# EAGLE design TLC4LEDShield (EAGLE 6.2)
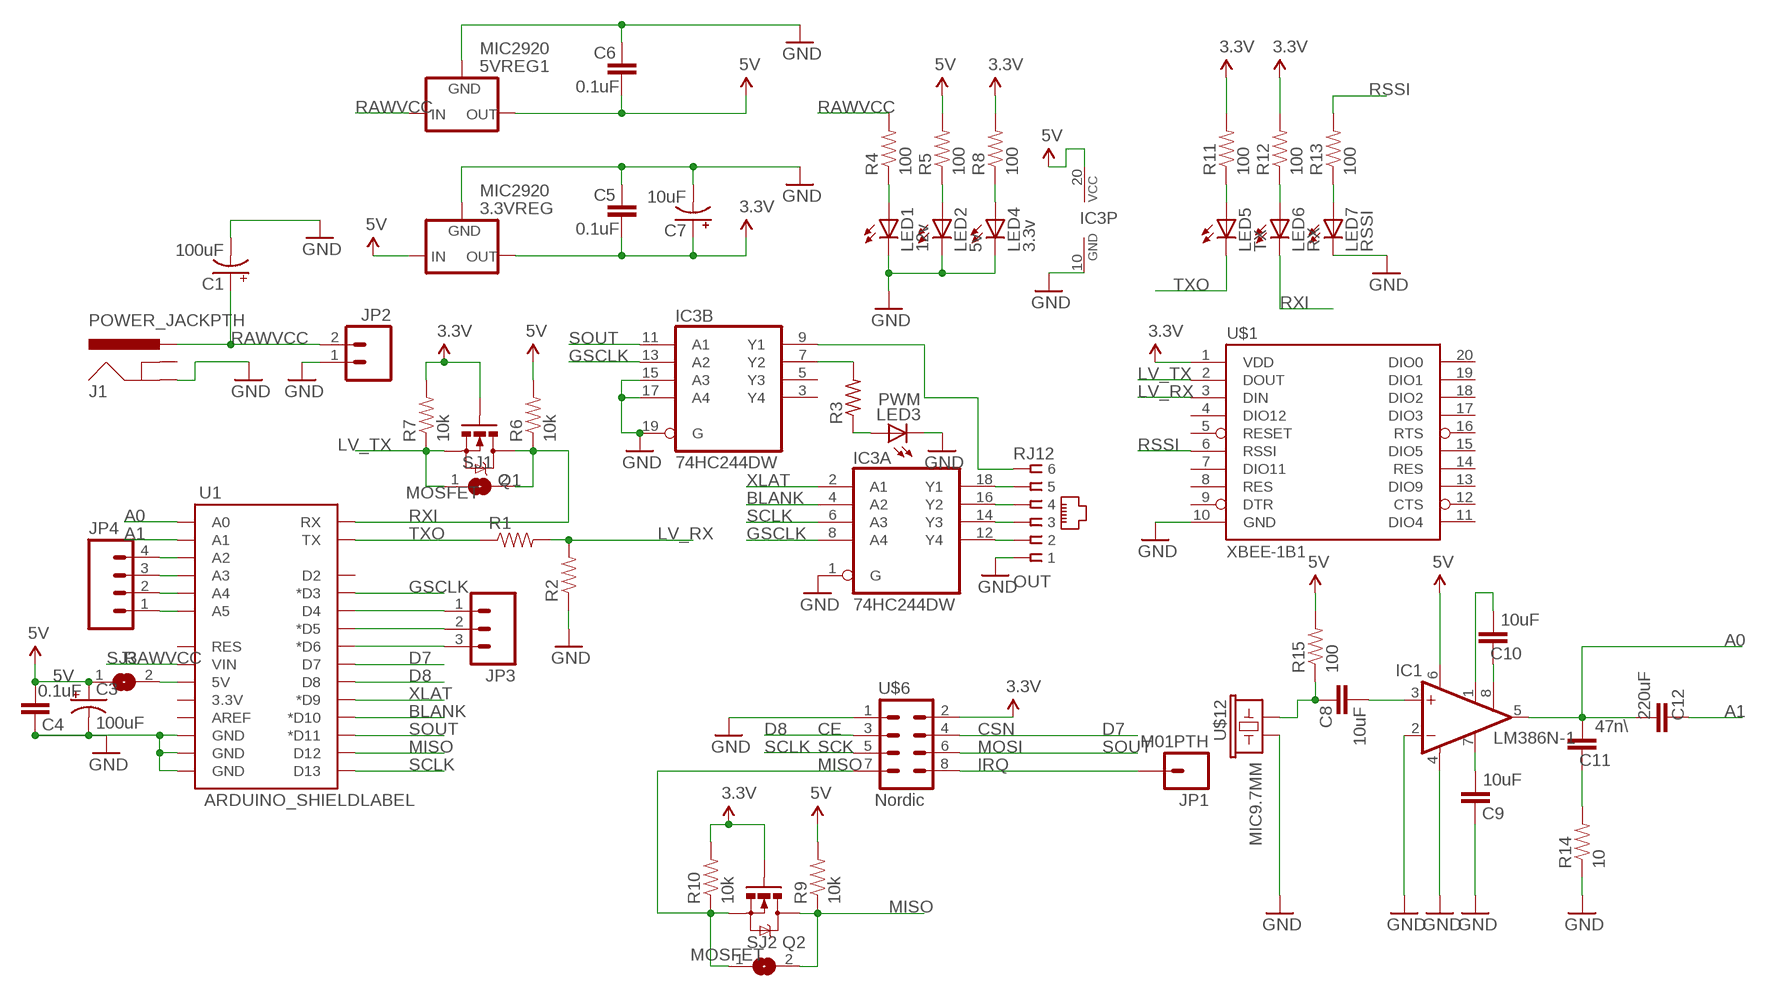
[diagram p0: schematic, sheet 1]

## Parts
3.3VREG  MIC2920  V_REG_MIC2920  [SOT223]
5VREG1  MIC2920  V_REG_MIC2920  [SOT223]
C1  100uF  CAP_POLD  [PANASONIC_D]
C3  100uF  CAP_POLD  [PANASONIC_D]
C4  0.1uF  CAP0805  [0805]
C5  0.1uF  CAP0805  [0805]
C6  0.1uF  CAP0805  [0805]
C7  10uF  CAP_POL1206  [EIA3216]
C8  10uF  CAP0805  [0805]
C9  10uF  CAP0805  [0805]
C10  10uF  CAP0805  [0805]
C11  47n\  CAP0805  [0805]
C12  220uF  CAP0805  [0805]
IC1  LM386N-1  [DIL08]
IC3  74HC244DW  [SO20W]
J1  POWER_JACKPTH  [POWER_JACK_PTH]
JP1  M01PTH  [1X01]
JP2  M025MM  [SCREWTERMINAL-5MM-2]
JP3  M03PTH  [1X03]
JP4  M04PTH  [1X04]
LED1  12v  LEDCHIPLED_0805  [CHIPLED_0805]
LED2  5v  LEDCHIPLED_0805  [CHIPLED_0805]
LED3  PWM  LEDCHIPLED_0805  [CHIPLED_0805]
LED4  3.3v  LEDCHIPLED_0805  [CHIPLED_0805]
LED5  TX  LEDCHIPLED_0805  [CHIPLED_0805]
LED6  RX  LEDCHIPLED_0805  [CHIPLED_0805]
LED7  RSSI  LEDCHIPLED_0805  [CHIPLED_0805]
OUT  RJ12  RJ11-6L-B  [RJ11-NO_SHIELD]
Q1  MOSFET  MOSFET-NCHANNELSMD  [SOT23-3]
Q2  MOSFET  MOSFET-NCHANNELSMD  [SOT23-3]
R1  RESISTOR0805-RES  [0805]
R2  RESISTOR0805-RES  [0805]
R3  R-US_R0805  [R0805]
R4  100  RESISTOR0805-RES  [0805]
R5  100  RESISTOR0805-RES  [0805]
R6  10k  RESISTOR0805-RES  [0805]
R7  10k  RESISTOR0805-RES  [0805]
R8  100  RESISTOR0805-RES  [0805]
R9  10k  RESISTOR0805-RES  [0805]
R10  10k  RESISTOR0805-RES  [0805]
R11  100  RESISTOR0805-RES  [0805]
R12  100  RESISTOR0805-RES  [0805]
R13  100  RESISTOR0805-RES  [0805]
R14  10  RESISTOR0805-RES  [0805]
R15  100  RESISTOR0805-RES  [0805]
SJ1  SJ  [SJ]
SJ2  SJ  [SJ]
SJ3  SJ  [SJ]
U1  ARDUINO_SHIELDLABEL  [DUEMILANOVE_SHIELD]
U$1  XBEE-1B1  [XBEE-1]
U$6  Nordic  M04X2  [2X4]
U$12  MIC9.7MM  [MIC-9.7MM]

## Nets
3.3V [medium]: 3.3VREG.3(OUT) C5.1 C7.A(+) Q1.1(G) Q2.1(G) R7.2 R8.2 R10.2 R11.2 R12.2 U$1.1(VDD) U$6.2
5V [medium]: 3.3VREG.1(IN) 5VREG1.3(OUT) C3.+ C4.1 C6.1 IC1.6(VS) IC3.20(P:VCC) R5.2 R6.2 R9.2 R15.2 SJ3.1
A0: C11.1 C12.1 IC1.5(OUT) U1.A0
A1: C12.2 U1.A1
BLANK: IC3.4(A:A2) U1.D10(*D10)
D7: U1.D7 U$6.4
D8: U1.D8 U$6.3
GND [PWR]: 3.3VREG.2(GND) 5VREG1.2(GND) C1.- C3.- C4.2 C5.2 C6.2 C7.C(-) C9.2 IC1.2(-IN) IC1.4(GND) IC3.1(A:G) IC3.10(P:GND) IC3.15(B:A3) IC3.17(B:A4) IC3.19(B:G) J1.GND JP2.1 LED1.C LED2.C LED3.C LED4.C LED7.C OUT.1 R2.1 R14.1 U1.GND@0(GND) U1.GND@1(GND) U1.GND@2(GND) U$1.10(GND) U$6.1 U$12.2
GSCLK: IC3.8(A:A4) IC3.13(B:A2) U1.D3(*D3)
LV_RX: R1.2 R2.2 U$1.3(DIN)
LV_TX: Q1.2(S) R7.1 SJ1.1 U$1.2(DOUT)
MISO: Q2.3(D) R9.1 SJ2.2 U1.D12
N$1: IC3.12(A:Y4) OUT.2
N$2: IC3.14(A:Y3) OUT.3
N$3: IC3.16(A:Y2) OUT.4
N$4: IC3.18(A:Y1) OUT.5
N$5: LED2.A R5.1
N$6: LED1.A R4.1
N$7: LED5.A R11.1
N$8: LED6.A R12.1
N$9: Q2.2(S) R10.1 SJ2.1 U$6.7
N$10: LED7.A R13.1
N$11: SJ3.2 U1.5V
N$12: JP1.1 U$6.8
N$13: LED4.A R8.1
N$14: JP3.1 U1.D4
N$15: JP3.2 U1.D5(*D5)
N$16: JP3.3 U1.D6(*D6)
N$17: JP4.1 U1.A5
N$18: IC3.9(B:Y1) OUT.6
N$19: JP4.2 U1.A4
N$20: IC3.7(B:Y2) R3.2
N$21: LED3.A R3.1
N$22: JP4.3 U1.A3
N$23: JP4.4 U1.A2
N$26: C8.1 IC1.3(+IN)
N$27: C9.1 IC1.7(BYPASS)
N$28: C10.2 IC1.8(GAIN)
N$29: C10.1 IC1.1(GAIN)
N$32: C11.2 R14.2
N$33: C8.2 R15.1 U$12.1
RAWVCC [PWR]: 5VREG1.1(IN) C1.+ J1.PWR JP2.2 R4.2 U1.VIN
RSSI: R13.2 U$1.6(RSSI)
RXI: LED6.C Q1.3(D) R6.1 SJ1.2 U1.RX
SCLK: IC3.6(A:A3) U1.D13 U$6.5
SOUT: IC3.11(B:A1) U1.D11(*D11) U$6.6
TXO: LED5.C R1.1 U1.TX
XLAT: IC3.2(A:A1) U1.D9(*D9)
Unconnected: IC3.3(B:Y4) IC3.5(B:Y3) J1.GNDBREAK U1.3.3V U1.AREF U1.D2 U1.RES U$1.4(DIO12) U$1.5(RESET) U$1.7(DIO11) U$1.8(RES) U$1.9(DTR) U$1.11(DIO4) U$1.12(CTS) U$1.13(DIO9) U$1.14(RES) U$1.15(DIO5) U$1.16(RTS) U$1.17(DIO3) U$1.18(DIO2) U$1.19(DIO1) U$1.20(DIO0)

## Notes on the sheet
- CE | CSN
- SCK | MOSI
- MISO | IRQ

## Library data of the parts
3.3VREG 5VREG1 = SparkFun:V_REG_MIC2920: MIC2920A (http://www.micrel.com/_PDF/mic2920.pdf) - 400mA output LDO Regulator
C1 C3 C7 = SparkFun:CAP_POL: Capacitor Polarized These are standard SMD and PTH capacitors. Normally 10uF, 47uF, and 100uF in electrolytic and tantalum varieties. Always verify the external diameter of the through hole cap, it varies with capacity, voltage, and manufacturer. The EIA devices should be standard.
C4-C6 C8-C12 = SparkFun:CAP: Capacitor Standard 0603 ceramic capacitor, and 0.1" leaded capacitor.
IC1 = linear:LM386?-*: Low Voltage Audio Power Amplifier Source: http://cache.national.com/ds/LM/LM386.pdf
IC3 = 74xx-eu:74*244: Octal BUFFER and LINE DRIVER, 3-state
J1 = SparkFun:POWER_JACK: Power Jack This is the standard 5.5mm barrel jack for power. The PTH is the most common, proven, reliable, footprint. All others are experimental. The Slot footprint only works if the mill layer is transmitted to the PCB fab house so be warned. Spark Fun Electronics SKU : PRT-00119. Mating wall wart : TOL-00298 (and others)
JP1 = SparkFun:M01: Header 1 Standard 1-pin 0.1" header. Use with straight break away headers (SKU : PRT-00116), right angle break away headers (PRT-00553), swiss pins (PRT-00743), machine pins (PRT-00117), and female headers (PRT-00115).
JP2 = SparkFun:M02: Header 2 Standard 2-pin 0.1" header. Use with straight break away headers (SKU : PRT-00116), right angle break away headers (PRT-00553), swiss pins (PRT-00743), machine pins (PRT-00117), and female headers (PRT-00115). Molex polarized connector foot print use with SKU : PRT-08233 with associated crimp pins and housings.
JP3 = SparkFun:M03: Header 3 Standard 3-pin 0.1" header. Use with straight break away headers (SKU : PRT-00116), right angle break away headers (PRT-00553), swiss pins (PRT-00743), machine pins (PRT-00117), and female headers (PRT-00115). Molex polarized connector foot print use with SKU : PRT-08232 with associated crimp pins and housings.
JP4 = SparkFun:M04: Header 4 Standard 4-pin 0.1" header. Use with straight break away headers (SKU : PRT-00116), right angle break away headers (PRT-00553), swiss pins (PRT-00743), machine pins (PRT-00117), and female headers (PRT-00115). Molex polarized connector foot print use with SKU : PRT-08231 with associated crimp pins and housings. 1MM SMD Version SKU: PRT-10208
LED1-LED7 = led:LED: LED OSRAM: - CHIPLED LG R971, LG N971, LY N971, LG Q971, LY Q971, LO R971, LY R971 LH N974, LH R974 LS Q976, LO Q976, LY Q976 LO Q996 - Hyper CHIPLED LW Q18S LB Q993, LB Q99A, LB R99A - SideLED LS A670, LO A670, LY A670, LG A670, LP A670 LB A673, LV A673, LT A673, LW A673 LH A674 LY A675 LS A676, LA A676, LO A676, LY A676, LW A676 LS A679, LY A679, LG A679 - Hyper Micro SIDELED® LS Y876, LA Y876, LO Y876, LY Y876 LT Y87S - SmartLED LW L88C, LW L88S LB L89C, LB L89S, LG L890 LS L89K, LO L89K, LY L89K LS L896, LA L896, LO L896, LY L896 - TOPLED LS T670, LO T670, LY T670, LG T670, LP T670 LSG T670, LSP T670, LSY T670, LOP T670, LYG T670 LG T671, LOG T671, LSG T671 LB T673, LV T673, LT T673, LW T673 LH T674 LS T676, LA T676, LO T676, LY T676, LB T676, LH T676, LSB T676, LW T676 LB T67C, LV T67C, LT T67C, LS T67K, LO T67K, LY T67K, LW E67C LS E67B, LA E67B, LO E67B, LY E67B, LB E67C, LV E67C, LT E67C LW T67C LS T679, LY T679, LG T679 LS T770, LO T770, LY T770, LG T770, LP T770 LB T773, LV T773, LT T773, LW T773 LH T774 LS E675, LA E675, LY E675, LS T675 LS T776, LA T776, LO T776, LY T776, LB T776 LHGB T686 LT T68C, LB T68C - Hyper Mini TOPLED® LB M676 - Mini TOPLED Santana® LG M470 LS M47K, LO M47K, LY M47K Source: http://www.osram.convergy.de LUXEON: - LUMILED® LXK2-PW12-R00, LXK2-PW12-S00, LXK2-PW14-U00, LXK2-PW14-V00 LXK2-PM12-R00, LXK2-PM12-S00, LXK2-PM14-U00 LXK2-PE12-Q00, LXK2-PE12-R00, LXK2-PE12-S00, LXK2-PE14-T00, LXK2-PE14-U00 LXK2-PB12-K00, LXK2-PB12-L00, LXK2-PB12-M00, LXK2-PB14-N00, LXK2-PB14-P00, LXK2-PB14-Q00 LXK2-PR12-L00, LXK2-PR12-M00, LXK2-PR14-Q00, LXK2-PR14-R00 LXK2-PD12-Q00, LXK2-PD12-R00, LXK2-PD12-S00 LXK2-PH12-R00, LXK2-PH12-S00 LXK2-PL12-P00, LXK2-PL12-Q00, LXK2-PL12-R00 Source: www.luxeon.com KINGBRIGHT: KA-3528ASYC Source: www.kingbright.com
OUT = con-tycoelectronics:RJ11: CORCOM Modular RJ Jacks No Shield Source: www.tycoelectronics.com .. ENG_DS_1654001_1099_RJ_L_0507.pdf; MF: TYCO ELECTRONICS; MPN: RJ11-6L-B; OC_FARNELL: unknown; OC_NEWARK: 52K3613
Q1 Q2 = SparkFun:MOSFET-NCHANNEL
R1 R2 R4-R15 = SparkFun:RESISTOR: Resistor Basic schematic elements and footprints for 0603, 1206, and PTH resistors.
R3 = rcl:R-US_: RESISTOR, American symbol
SJ1-SJ3 = jumper:SJ: SMD solder JUMPER
U1 = SparkFun:ARDUINO_SHIELD
U$1 = SparkFun:XBEE-1
U$6 = SparkFun:M04X2
U$12 = SparkFun:MIC: Microphone Omni-directional electret microphone. 9.7mm standard diameter.

## Net classes
0 SIGNAL: width 0.254 mm
1 PWR: width 0.508 mm
2 medium: width 0.305 mm

## Board
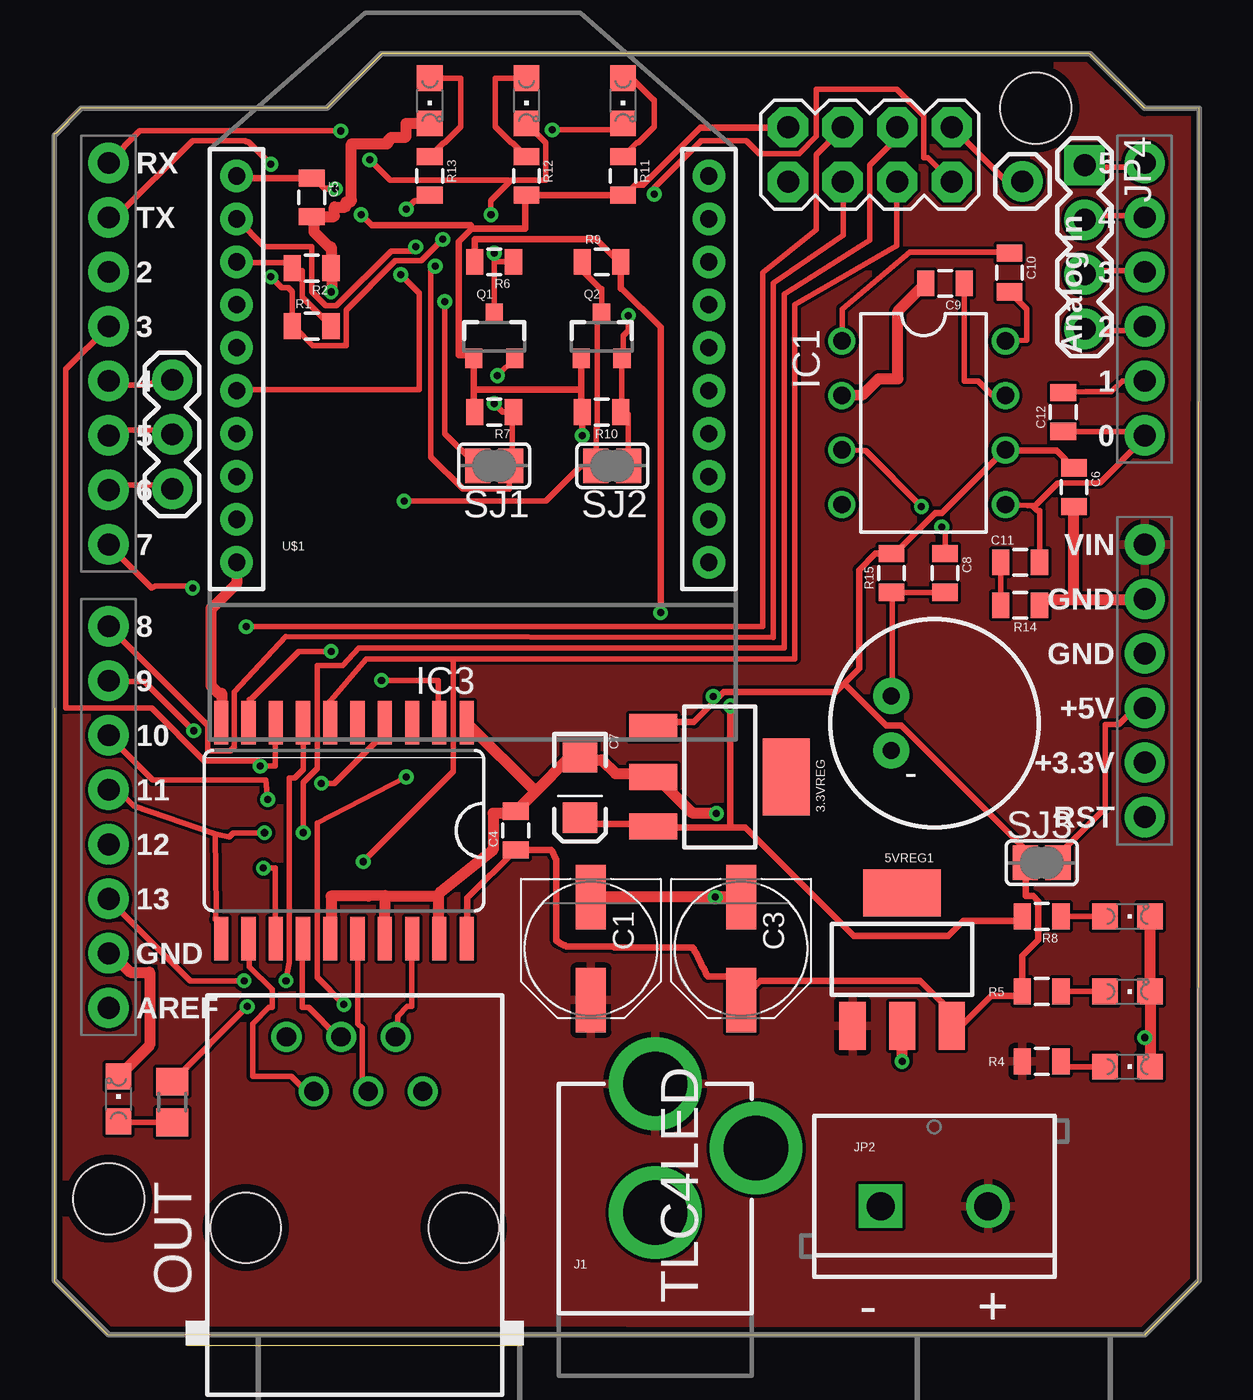
[diagram p1: board, top side]
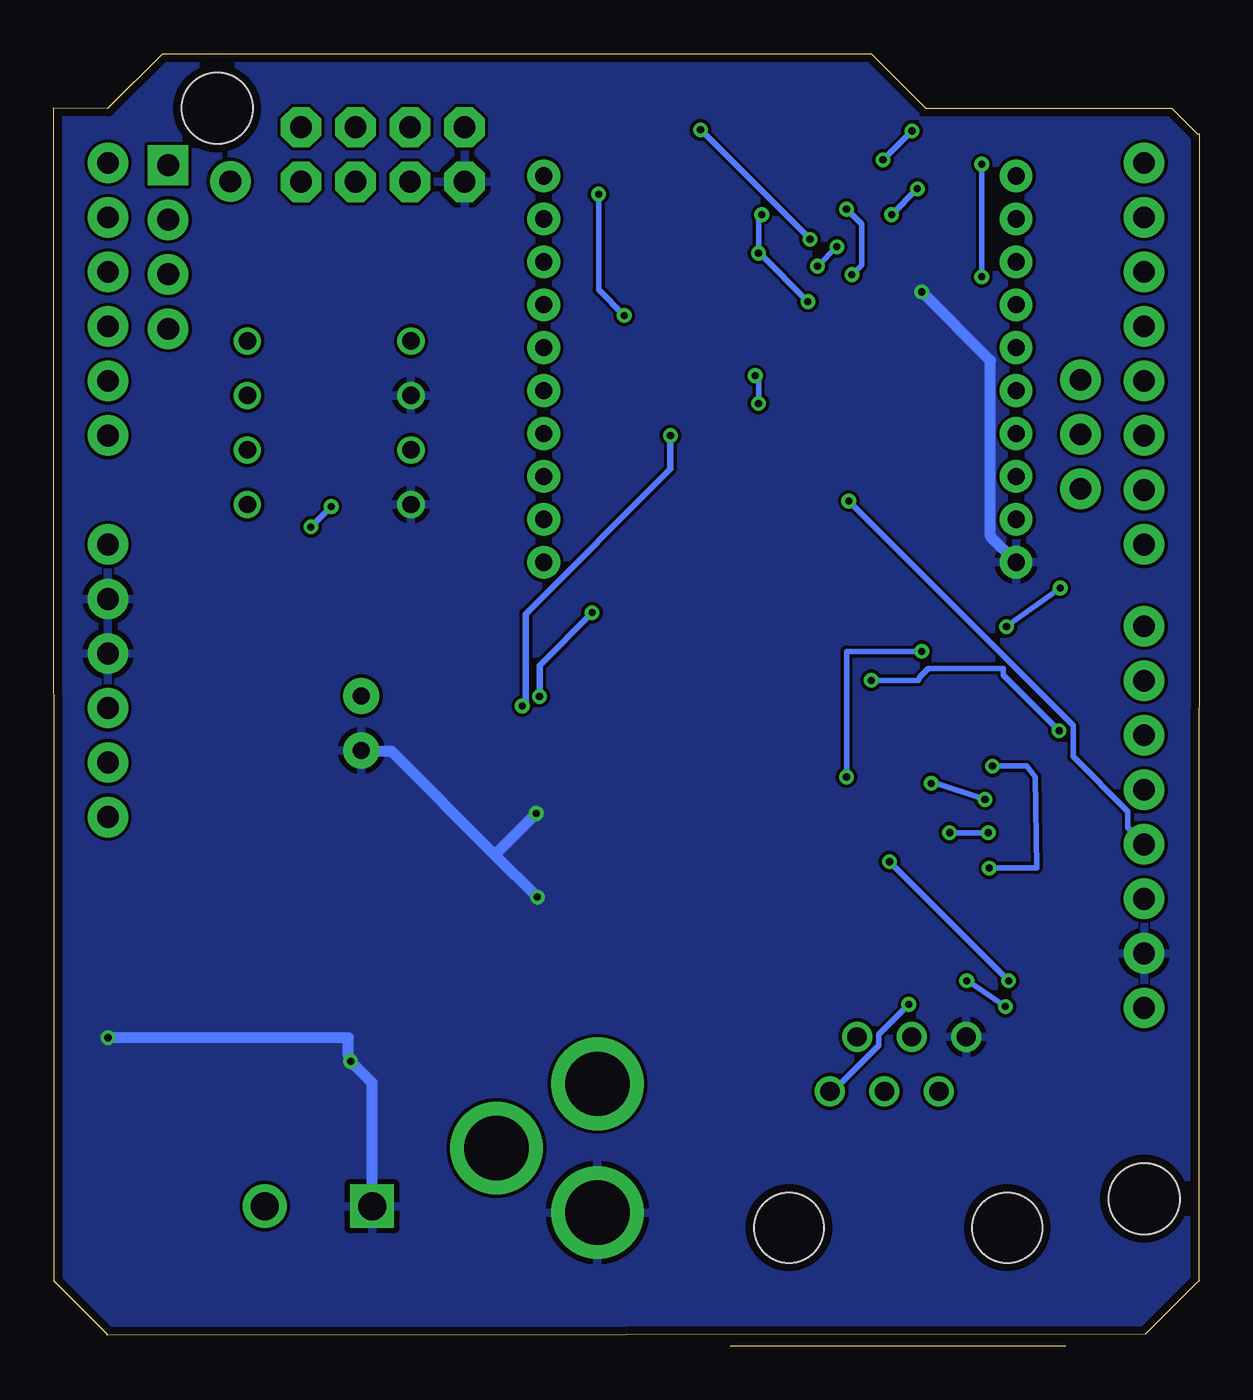
[diagram p2: board, bottom side, seen from below]

Size 53.35 x 59.72 mm. Coordinates in mm from the lower left corner, seen from the top.
Outline: 2.5,0.05 50.85,0 50.85,0.05 53.32,2.52 53.35,57.19 50.82,57.17 48.27,59.72 15.27,59.72 12.72,57.17 1.27,57.17 0.09,55.99 0,55.99 0.02,2.52 0.1,2.44 2.5,0.05
Copper layers (1*16): Top 0.0356mm / dielectric 1.5011mm / Bottom 0.0356mm
Design rules: minimum track width 6mil, minimum drill 13mil, track to track 6mil, track to pad 6mil, pad to pad 6mil, via to via 6mil, smd to smd 6mil, copper to edge 15mil, drill to drill 6mil, minimum pad ring 7mil, minimum via ring 7mil, stop-mask expansion 4mil, vias tented up to drill 0mil, thermal gap 10mil

### Footprints (pad centres in the part's own frame; a part is rotated, then mirrored left to right if it is on the bottom)
SOT223 = smd 1.219 x 2.235: 1 -2.311,-3.099; 2 0,-3.099; 3 2.311,-3.099 | smd 3.6 x 2.2: 4 0,3.099
PANASONIC_D = smd 3 x 1.4: + 2.4,0; - -2.4,0
0805 = smd 0.8 x 1.2: 1 -0.9,0; 2 0.9,0
EIA3216 = smd 1.4 x 1.6: A 1.4,0; C -1.4,0
DIL08 = drill 0.813 pad 1.27: 1 -3.81,-3.81; 2 -1.27,-3.81; 3 1.27,-3.81; 4 3.81,-3.81; 5 3.81,3.81; 6 1.27,3.81; 7 -1.27,3.81; 8 -3.81,3.81
SO20W = smd 0.66 x 2.032: 1 -5.715,-5.029; 2 -4.445,-5.029; 3 -3.175,-5.029; 4 -1.905,-5.029; 5 -0.635,-5.029; 6 0.635,-5.029; 7 1.905,-5.029; 8 3.175,-5.029; 9 4.445,-5.029; 10 5.715,-5.029; 11 5.715,5.029; 12 4.445,5.029; 13 3.175,5.029; 14 1.905,5.029; 15 0.635,5.029; 16 -0.635,5.029; 17 -1.905,5.029; 18 -3.175,5.029; 19 -4.445,5.029; 20 -5.715,5.029
POWER_JACK_PTH = drill 2.997 pad 4.318: GND 0,7.7; GNDBREAK 4.7,10.7; PWR 0,13.7
1X01 = drill 1.016 pad 1.88: 1 0,0
SCREWTERMINAL-5MM-2 = drill 1.3 pad 2.032 square: 1 0,0 | drill 1.3 pad 2.032: 2 5,0
1X03 = drill 1.016 pad 1.88: 1 0,0; 2 2.54,0; 3 5.08,0
1X04 = drill 1.016 pad 1.88 square: 1 0,0 | drill 1.016 pad 1.88: 2 2.54,0; 3 5.08,0; 4 7.62,0
CHIPLED_0805 = smd 1.2 x 1.2: A 0,-1.05; C 0,1.05
RJ11-NO_SHIELD = drill 0.9 pad 1.4: 1 -3.175,8.89; 2 -1.905,6.35; 3 -0.635,8.89; 4 0.635,6.35; 5 1.905,8.89; 6 3.175,6.35 | hole 3.251: -5.08,0; 5.08,0
SOT23-3 = smd 0.8 x 0.9: 1 -0.95,-1; 2 0.95,-1; 3 0,1.1
R0805 = smd 1.3 x 1.5: 1 -0.95,0; 2 0.95,0
SJ = smd 1.168 x 1.6: 1 -0.762,0; 2 0.762,0
DUEMILANOVE_SHIELD = drill 1.016 pad 1.88: 3.3V 50.8,26.67; 5V 50.8,29.21; A0 50.8,41.91; A1 50.8,44.45; A2 50.8,46.99; A3 50.8,49.53; A4 50.8,52.07; A5 50.8,54.61; AREF 2.54,15.24; D2 2.54,49.53; D3 2.54,46.99; D4 2.54,44.45; D5 2.54,41.91; D6 2.54,39.37; D7 2.54,36.83; D8 2.54,33.02; D9 2.54,30.48; D10 2.54,27.94; D11 2.54,25.4; D12 2.54,22.86; D13 2.54,20.32; GND@0 50.8,31.75; GND@1 50.8,34.29; GND@2 2.54,17.78; RES 50.8,24.13; RX 2.54,54.61; TX 2.54,52.07; VIN 50.8,36.83 | hole 3.302: 45.72,57.15; 2.54,6.35
XBEE-1 = drill 0.8 pad 1.524: 1 -11,20; 2 -11,18; 3 -11,16; 4 -11,14; 5 -11,12; 6 -11,10; 7 -11,8; 8 -11,6; 9 -11,4; 10 -11,2; 11 11,2; 12 11,4; 13 11,6; 14 11,8; 15 11,10; 16 11,12; 17 11,14; 18 11,16; 19 11,18; 20 11,20
2X4 = drill 1.016 pad 1.88 octagon: 1 -3.81,-1.27; 2 -3.81,1.27; 3 -1.27,-1.27; 4 -1.27,1.27; 5 1.27,-1.27; 6 1.27,1.27; 7 3.81,-1.27; 8 3.81,1.27
MIC-9.7MM = drill 0.8 pad 1.676: 1 -2,1.27; 2 -2,-1.27

### Placement (x,y rotation side)
3.3VREG  31.02,26.02 270 top
5VREG1  39.52,17.52 0 top
C1  25.02,18.02 270 top
C3  32.02,18.02 270 top
C4  21.52,23.52 90 top
C5  12.02,53.02 270 top
C6  47.52,39.52 270 top
C7  24.52,25.52 270 top
C8  41.52,35.52 270 top
C9  41.52,49.02 180 top
C10  44.52,49.52 270 top
C11  45.02,36.02 180 top
C12  47.02,43.02 90 top
IC1  40.52,42.52 270 top
IC3  13.52,23.52 180 top
J1  28.02,-1.98 0 top
JP1  45.12,53.77 0 top
JP2  38.52,6.02 0 top
JP3  5.52,44.52 270 top
JP4  48.02,54.52 270 top
LED1  50.02,12.52 270 top
LED2  50.02,16.02 270 top
LED3  3.02,11.02 0 top
LED4  50.02,19.52 270 top
LED5  26.52,57.52 180 top
LED6  22.02,57.52 180 top
LED7  17.52,57.52 180 top
OUT  14.02,5.02 0 top
Q1  20.52,46.52 0 top
Q2  25.52,46.52 0 top
R1  12.02,47.02 0 top
R2  12.02,49.72 180 top
R3  5.52,10.87 90 top
R4  46.02,12.77 180 top
R5  46.02,16.02 180 top
R6  20.52,50.02 180 top
R7  20.52,43.02 180 top
R8  46.02,19.52 180 top
R9  25.52,50.02 0 top
R10  25.52,43.02 180 top
R11  26.52,54.02 270 top
R12  22.02,54.02 270 top
R13  17.52,54.02 270 top
R14  45.02,34.02 180 top
R15  39.02,35.52 90 top
SJ1  20.52,40.52 180 top
SJ2  26.02,40.52 180 top
SJ3  46.02,22.02 0 top
U1  0.02,0.02 0 top
U$1  19.52,34.02 0 top
U$6  38.02,55.02 0 top
U$12  41.02,28.52 0 top

### Tracks (layer width: path | path; a pad name or v marks a point on that pad's centre or on a via)
3.3V  (via drill 0.33)
  Top 0.305: C7.A 24.82,23.82 27.82,23.82 3.3VREG.3 28.07,23.67 31.52,23.67 | U$1.1 8.62,53.92 C5.1 12.17,53.87 12.62,53.42 v13.12,53.42 | R8.2 44.92,19.32 42.37,19.32 41.67,18.62 37.27,18.62 32.22,23.67 31.52,23.67 | 24.57,44.07 24.57,43.02 R10.2 v24.62,41.92 | 24.57,44.07 Q2.1 | U$6.2 34.17,56.27 30.12,56.27 27.47,53.62 27.12,53.62 26.67,53.17 R11.2 R12.2 21.97,52.97 21.97,51.57 19.47,51.57 | v31.52,29.32 31.52,23.67 | 19.57,44.07 19.57,43.02 R7.2 | 19.57,44.07 Q1.1 19.52,45.67 18.87,45.67 18.87,50.97 19.47,51.57 | 24.57,44.07 19.57,44.07 | v14.32,52.22 14.82,51.72 19.42,51.72 19.47,51.57
  Bottom 0.305: v31.52,29.32 31.37,29.47 31.37,33.62 24.62,40.37 v24.62,41.92 | v14.32,52.22 v13.12,53.42
5V  (via drill 0.33)
  Top 0.305: IC3.20 19.27,18.52 19.27,20.37 C4.1 23.17,22.62 23.22,22.57 23.22,22.52 23.27,22.47 23.27,22.42 23.32,22.37 23.32,22.32 23.37,22.27 23.37,22.22 23.42,22.17 23.42,18.37 23.47,18.32 23.52,18.32 23.57,18.27 23.62,18.27 23.67,18.22 23.72,18.22 23.77,18.17 23.82,18.17 23.87,18.12 26.07,18.12 26.12,18.07 29.77,18.07 29.82,18.02 29.82,17.97 29.87,17.92 29.87,17.87 29.92,17.82 29.92,17.77 29.97,17.72 29.97,17.67 30.02,17.62 30.02,17.57 30.07,17.52 30.07,17.47 30.12,17.42 30.12,17.37 30.17,17.32 30.17,17.27 30.22,17.22 30.22,17.17 30.27,17.12 30.27,17.07 30.32,17.02 30.32,16.97 30.37,16.92 30.37,16.87 30.42,16.82 30.42,16.77 30.47,16.72 32.02,16.72 C3.+ 32.92,16.52 40.37,16.52 42.27,14.62 5VREG1.3 41.87,14.47 42.32,14.47 43.67,15.82 44.92,15.82 R5.2 45.12,17.67 45.87,18.42 45.87,20.22 45.62,20.47 45.27,20.47 SJ3.1 45.22,22.17 45.22,22.67 39.47,28.42 38.77,28.42 36.82,30.37 | 30.87,29.62 31.22,29.97 36.42,29.97 36.82,30.37 | 30.87,29.62 29.82,28.57 28.17,28.57 27.97,28.37 3.3VREG.1 | 36.82,30.37 37.52,31.07 37.52,35.67 38.27,36.42 R15.2 39.17,36.47 39.22,36.47 41.07,38.32 41.37,38.32 44.22,41.17 IC1.6 44.37,41.22 46.72,41.22 C6.1 | v28.27,33.67 28.27,46.97 26.47,48.77 26.42,48.77 R9.2 26.27,50.07 25.27,51.07 19.62,51.07 R6.2 | v30.72,29.77 30.87,29.62
  Bottom 0.305: v28.27,33.67 30.72,31.22 v30.72,29.77
A0
  Top 0.254: C11.1 45.92,38.42 45.82,38.42 45.57,38.67 45.37,38.67 IC1.5 45.72,38.67 46.77,39.72 48.72,39.72 50.82,41.82 U1.A0 50.82,41.97 50.67,42.12 C12.1
A1
  Top 0.254: C12.2 48.07,43.97 49.27,43.97 49.77,44.47 U1.A1
BLANK  (via drill 0.33)
  Top 0.254: v12.47,25.72 13.07,25.72 15.02,27.67 15.42,27.67 15.42,28.52 IC3.4 | v9.97,24.97 9.87,25.87 4.62,25.87 2.57,27.92 U1.D10
  Bottom 0.254: v12.47,25.72 12.22,25.72 v9.97,24.97
D7  (via drill 0.33)
  Top 0.254: v8.97,33.02 33.02,33.02 33.02,49.52 35.52,51.52 35.52,55.02 36.77,56.27 36.77,56.32 U$6.4 | U1.D7 2.57,36.82 4.57,34.82 4.67,34.87 4.72,34.92 6.22,34.92 6.32,34.82 v6.47,34.82
  Bottom 0.254: v8.97,33.02 v6.47,34.82
D8
  Top 0.254: U1.D8 2.57,33.02 7.17,28.42 7.17,27.22 8.22,27.22 8.42,27.42 8.42,29.97 10.82,32.57 33.52,32.52 33.52,49.02 36.77,51.27 36.77,53.77 U$6.3
GND  (via drill 0.33)
  Top 0.508: 7.82,28.57 IC3.10 7.82,28.82 7.82,29.92 7.67,29.92 7.32,30.27 7.32,33.87 7.37,33.87 8.52,35.02 U$1.10 | R14.1 46.17,34.27 47.52,34.27 | 47.52,34.27 50.82,34.27 U1.GND@1 | 47.52,34.27 C6.2 | C9.2 39.32,47.72 39.32,44.57 38.42,44.57 37.67,43.82 IC1.2 | 51.07,13.87 LED2.C LED4.C | 51.07,13.87 LED1.C | v39.52,12.77 5VREG1.2 | v50.82,13.87 51.07,13.87 | C3.- v30.82,20.42 C1.- | LED7.C 16.42,56.47 16.42,55.87 16.37,55.82 15.72,55.82 15.67,55.77 15.67,55.72 15.62,55.67 15.57,55.67 15.57,55.57 15.52,55.52 13.87,55.52 13.87,52.87 13.82,52.82 13.62,52.82 13.62,52.62 13.57,52.57 13.07,52.57 13.07,52.17 13.02,52.12 C5.2 12.12,51.87 12.12,51.42 12.82,50.72 12.92,50.72 R2.1 12.97,49.47 12.97,48.62 v12.92,48.62 | 15.45,20.5 15.42,19.17 15.42,18.52 IC3.17 | 15.45,20.5 14.67,20.47 12.92,20.47 12.92,18.52 IC3.15 | 17.92,20.47 17.92,18.52 IC3.19 | 17.92,20.47 15.42,20.47 15.45,20.5 | 22.45,25.35 23.97,26.87 24.27,26.87 C7.C 24.77,26.82 25.52,26.82 26.17,26.17 27.77,26.17 3.3VREG.2 28.17,25.92 29.77,24.32 v30.87,24.32 | 22.45,25.35 C4.2 21.27,24.32 20.47,24.32 20.47,22.62 18.02,20.67 17.92,20.47 | 22.45,25.35 19.27,28.52 IC3.1 | LED3.C 4.47,13.52 4.47,16.92 3.57,16.92 2.72,17.77 2.57,17.77 U1.GND@2
  Bottom 0.508: JP2.1 38.52,11.77 v39.52,12.77 39.62,13.02 39.62,13.87 v50.82,13.87 | 32.8,22.39 37.62,27.22 39.02,27.22 U$12.2 | 32.8,22.39 v30.82,20.42 | v12.92,48.62 9.72,45.42 9.72,37.22 U$1.10 | 32.8,22.39 v30.87,24.32
  pour Bottom: 0.37,68.53 53.16,67.53 53.16,-0.43 0.37,-0.93
GSCLK  (via drill 0.33)
  Top 0.254: 10.37,28.52 IC3.8 10.32,28.42 10.32,26.52 v9.62,26.52 9.52,26.77 7.02,26.77 4.57,29.22 0.57,29.22 0.57,45.02 U1.D3 | v9.77,21.77 10.32,21.77 10.32,18.52 IC3.13
  Bottom 0.254: v9.77,21.77 7.57,21.77 7.62,26.02 8.02,26.52 v9.62,26.52
LV_RX
  Top 0.254: U$1.3 8.57,49.97 10.87,49.97 R2.2 11.17,49.62 11.57,49.62 11.57,48.37 R1.2
LV_TX  (via drill 0.33)
  Top 0.254: 21.32,40.52 SJ1.1 | 21.32,42.97 R7.1 | SJ1.1 21.37,40.62 21.37,42.77 21.32,42.77 R7.1 | v20.67,44.72 Q1.2 | v20.52,43.42 20.92,43.02 R7.1 | v17.77,49.82 17.57,49.82 17.57,40.92 19.07,39.42 21.22,39.42 21.22,40.42 SJ1.1 | v16.87,50.72 16.67,50.52 15.72,50.52 13.17,47.97 12.67,47.97 12.02,48.62 12.02,50.72 9.82,50.72 U$1.2
  Bottom 0.254: v20.67,44.72 20.52,44.57 v20.52,43.42 | v16.87,50.72 v17.77,49.82
MISO  (via drill 0.33)
  Top 0.254: R9.1 24.62,49.62 25.47,48.77 25.52,48.77 Q2.3 25.42,47.57 25.32,47.57 25.32,42.32 25.27,42.27 SJ2.2 25.17,40.47 24.52,40.47 22.92,38.87 v16.32,38.87
  Bottom 0.254: v16.32,38.87 5.87,28.42 5.87,26.97 3.32,24.42 3.32,23.67 2.57,22.92 U1.D12
N$1
  Top 0.254: OUT.2 11.77,11.37 11.07,12.07 9.27,12.07 9.27,14.52 10.02,15.27 10.17,15.27 10.17,16.12 9.12,17.17 9.12,18.47 IC3.12
N$2
  Top 0.254: IC3.14 11.57,18.47 11.57,15.27 11.87,15.27 13.22,13.92 13.37,13.92 OUT.3
N$3
  Top 0.254: OUT.4 14.37,11.37 14.37,14.32 14.17,14.52 14.17,18.47 IC3.16
N$4
  Top 0.254: IC3.18 16.67,18.47 16.67,15.32 16.47,15.32 16.02,14.87 16.02,13.92 15.97,13.92 OUT.5
N$5
  Top 0.254: LED2.A R5.1
N$6
  Top 0.254: R4.1 47.17,12.52 LED1.A
N$7
  Top 0.254: R11.1 27.17,55.57 27.22,55.57 27.97,56.32 27.97,57.57 27.92,57.57 26.92,58.57 LED5.A
N$8
  Top 0.254: R12.1 21.37,55.57 21.32,55.57 20.57,56.32 20.57,58.57 LED6.A
N$9  (via drill 0.33)
  Top 0.254: SJ2.1 26.77,42.92 26.52,42.92 R10.1 26.47,43.02 Q2.2 26.52,45.62 26.52,46.57 26.77,46.82 v26.77,47.52 | v27.97,53.17 27.97,53.47 30.17,55.67 32.27,55.67 32.87,55.07 34.72,55.07 35.52,55.87 35.52,58.07 39.27,58.07 40.52,56.82 40.52,54.87 40.72,54.87 41.82,53.77 U$6.7
  Bottom 0.254: v26.77,47.52 27.97,48.72 v27.97,53.17
N$10
  Top 0.254: R13.1 18.17,55.57 18.22,55.57 18.97,56.32 18.97,58.57 LED7.A
N$11
  Top 0.254: SJ3.2 46.82,22.02 46.82,22.67 47.07,22.67 48.97,24.57 48.97,28.47 49.62,28.47 50.37,29.22 U1.5V
N$12
  Top 0.254: JP1.1 44.37,53.77 41.87,56.27 U$6.8
N$13
  Top 0.254: LED4.A R8.1
N$14
  Top 0.254: JP3.1 4.72,44.52 4.47,44.27 2.77,44.27 U1.D4
N$15
  Top 0.254: U1.D5 2.57,41.97 2.77,42.17 5.37,42.17 5.52,42.02 JP3.2
N$16
  Top 0.254: U1.D6 2.57,39.42 2.77,39.62 5.37,39.62 5.52,39.47 JP3.3
N$17
  Top 0.254: JP4.1 48.12,54.42 49.97,54.42 50.17,54.62 U1.A5
N$18  (via drill 0.33)
  Top 0.254: v12.92,31.87 11.42,31.87 9.17,29.62 9.12,29.62 9.12,28.57 IC3.9 | v16.42,26.02 12.27,23.87 12.27,16.67 v13.52,15.42
  Bottom 0.254: v12.92,31.87 16.42,31.87 v16.42,26.02 | v13.52,15.42 14.92,14.02 14.92,13.52 17.07,11.37 OUT.6
N$19
  Top 0.254: JP4.2 48.02,52.02 48.17,52.17 50.77,52.17 50.82,52.12 U1.A4
N$20  (via drill 0.33)
  Top 0.254: v9.02,15.32 R3.2 | v10.82,16.52 10.97,17.37 10.97,25.97 11.22,25.97 11.62,26.37 11.62,28.52 IC3.7
  Bottom 0.254: v9.02,15.32 10.57,16.37 v10.82,16.52
N$21
  Top 0.254: LED3.A 3.07,9.92 R3.1
N$22
  Top 0.254: JP4.3 48.02,49.47 48.17,49.62 50.77,49.62 50.82,49.57 U1.A3
N$23
  Top 0.254: JP4.4 48.02,46.87 48.07,46.82 50.67,46.82 50.82,46.97 U1.A2
N$26  (via drill 0.33)
  Top 0.254: C8.1 41.52,37.67 v41.37,37.67 | v40.42,38.62 37.82,41.22 37.72,41.22 IC1.3
  Bottom 0.254: v40.42,38.62 v41.37,37.67
N$27
  Top 0.254: C9.1 42.42,44.47 43.07,44.47 43.72,43.82 44.32,43.82 IC1.7
N$28
  Top 0.254: C10.2 45.32,47.82 45.32,46.37 IC1.8
N$29
  Top 0.254: C10.1 44.47,50.47 39.87,50.47 36.72,47.82 36.72,45.87 IC1.1
N$32
  Top 0.254: C11.2 R14.2
N$33
  Top 0.254: C8.2 R15.1 39.07,34.52 39.07,29.82 39.02,29.82 U$12.1
RAWVCC
  pour Top: -0.13,68.53 52.66,68.03 53.66,-0.93 -0.13,-0.93
RSSI  (via drill 0.33)
  Top 0.254: R13.2 17.27,52.87 16.82,52.87 v16.42,52.47 | v16.17,49.42 17.02,48.57 17.02,44.07 8.57,44.07 U$1.6
  Bottom 0.254: v16.42,52.47 15.72,51.77 15.72,49.87 v16.17,49.42
RXI  (via drill 0.33)
  Top 0.254: 20.52,50.02 Q1.3 | R6.1 20.52,50.02 | LED6.C 22.92,55.57 22.92,53.82 21.32,53.82 21.25,53.74 | 21.25,53.74 20.37,52.87 v20.37,52.22 | 20.52,50.02 v20.52,50.42 | v18.22,48.17 18.22,42.02 19.72,40.52 SJ1.2 | v13.37,56.12 4.02,56.12 2.57,54.67 U1.RX | v14.72,54.77 15.67,53.82 21.17,53.82 21.25,53.74
  Bottom 0.254: v20.37,52.22 20.52,52.07 v20.52,50.42 20.42,50.37 v18.22,48.17 | v14.72,54.77 v13.37,56.12
SCLK  (via drill 0.33)
  Top 0.254: 18.62,31.52 34.52,31.52 34.52,48.02 39.27,50.77 39.27,53.77 39.32,53.77 U$6.5 | 18.62,31.52 14.57,31.52 12.77,29.42 12.92,29.42 12.92,28.57 IC3.6 | v8.87,16.52 6.37,16.52 2.57,20.32 U1.D13 | v14.42,22.07 18.62,26.27 18.62,31.52
  Bottom 0.254: v14.42,22.07 v8.87,16.52
SOUT  (via drill 0.33)
  Top 0.254: 7.52,23.37 7.57,19.82 7.52,19.37 7.77,19.37 7.77,18.52 IC3.11 | 7.52,23.37 3.72,24.67 2.97,25.42 U1.D11 | 39.32,56.32 U$6.6 39.27,56.27 39.27,55.77 38.02,54.52 38.02,51.02 34.02,48.52 34.02,32.02 14.22,32.02 13.47,31.22 12.27,31.22 12.27,26.42 11.62,25.77 v11.62,23.42 | v9.82,23.42 8.37,23.42 8.17,23.22 7.52,23.37
  Bottom 0.254: v11.62,23.42 v9.82,23.42
TXO  (via drill 0.33)
  Top 0.254: v10.12,49.32 10.62,48.82 10.92,48.82 11.12,48.62 R1.1 11.22,46.97 12.07,46.12 13.62,46.12 13.62,47.77 15.92,50.07 17.12,50.07 v18.12,51.07 | v10.12,54.57 9.07,55.62 8.97,55.62 8.92,55.67 6.47,55.67 2.92,52.12 2.57,52.12 U1.TX | LED5.C 26.22,56.17 v23.22,56.17
  Bottom 0.254: v10.12,54.57 v10.12,49.32 | v18.12,51.07 v23.22,56.17
XLAT  (via drill 0.33)
  Top 0.254: v15.27,30.52 17.92,30.52 17.92,28.57 IC3.2 | v6.52,28.17 4.22,30.47 2.57,30.47 U1.D9
  Bottom 0.254: v15.27,30.52 13.07,30.52 13.02,30.67 12.62,31.07 9.12,31.07 9.12,30.77 v6.52,28.17

### Text on the board
tNames: TLC4LED | - | +